# EasyEDA schematic SCH_POC-HC-05_2022-12-13.json
TITLE: POC_HC-05; REV: 1.0; Date: 2022-12-13; Sheet: 1/1; Drawn By: milanvannieuwenhuyze; Company: HoGent
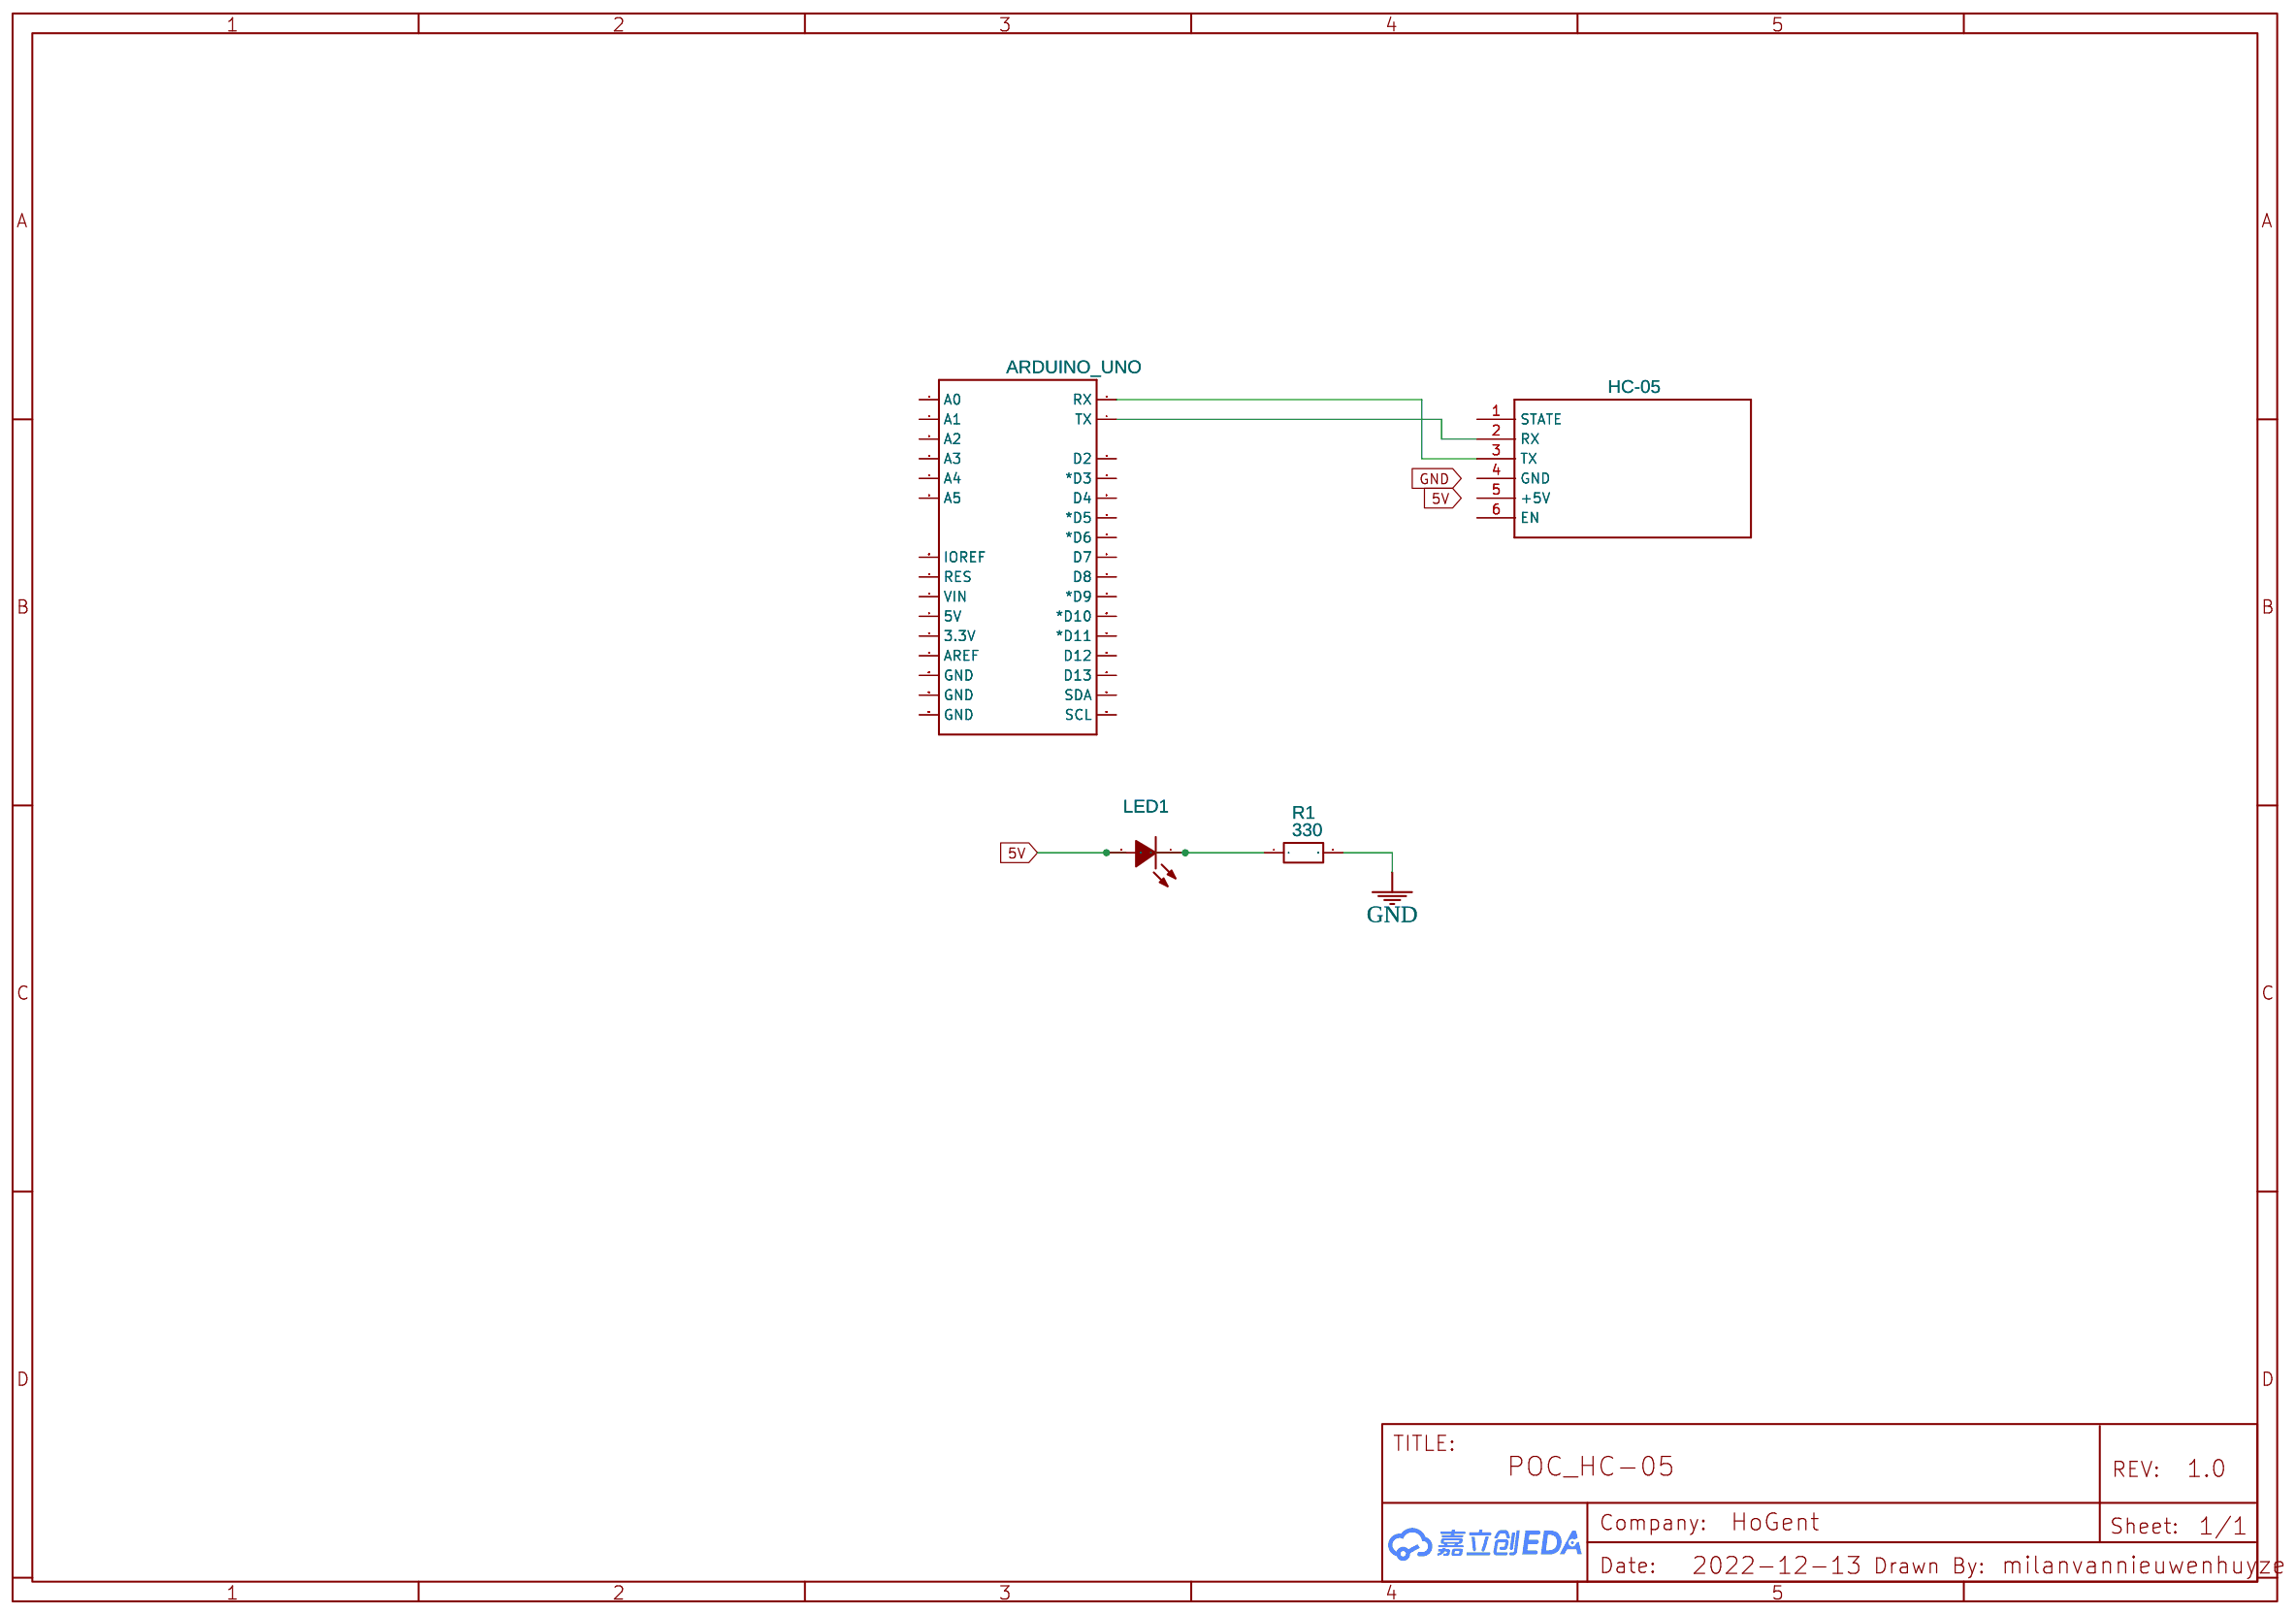
[diagram p0: schematic sheet]

## Parts
1  HC-05  [WIRELESS-BLUETOOTH-HC-05]
LED1  BL-HUE35A-AV-TRE  [LED0805-RD_BRTLED_BL-HUE35A-AV-TRE]
R1  330  [R0603]
U1  ARDUINO_UNO  [UNO_R3_SHIELD_NOLABELS]

## Library data of the parts
1 = WIRELESS-BLUETOOTH-HC-05: Contributor: Apdo Elnbrawy
LED1 = BL-HUE35A-AV-TRE: Supplier: LCSC; Manufacturer: BrtLed; Contributor: LCSC; Supplier Part: C138549; JLCPCB Part Class: Extended Part
R1 = R_0603_EU: Contributor: LCEDA_Lib
U1 = ARDUINO_R3_SHIELD: Contributor: SparkFun

## Nets
5V: LED1.2(A)
GND: R1.2
Net-(1-2): 1.2(RX) U1.TX
Net-(1-3): 1.3(TX) U1.RX
Net-(LED1-1): LED1.1(K) R1.1

Not connected (* = marked no-connect by the designer): 1 1(STATE) 4(GND) 5(+5V) 6(EN); U1 3.3V 5V A0 A1 A2 A3 A4 A5 AREF D2 D3(*D3) D4 D5(*D5) D6(*D6) D7 D8 D9(*D9) D10(*D10) D11(*D11) D12 D13 GND@0(GND) GND@1(GND) GND@2(GND) IOREF RES SCL SDA VIN
